# Altium schematic sheet DS_ZK_FINAL.SchDoc
size A1
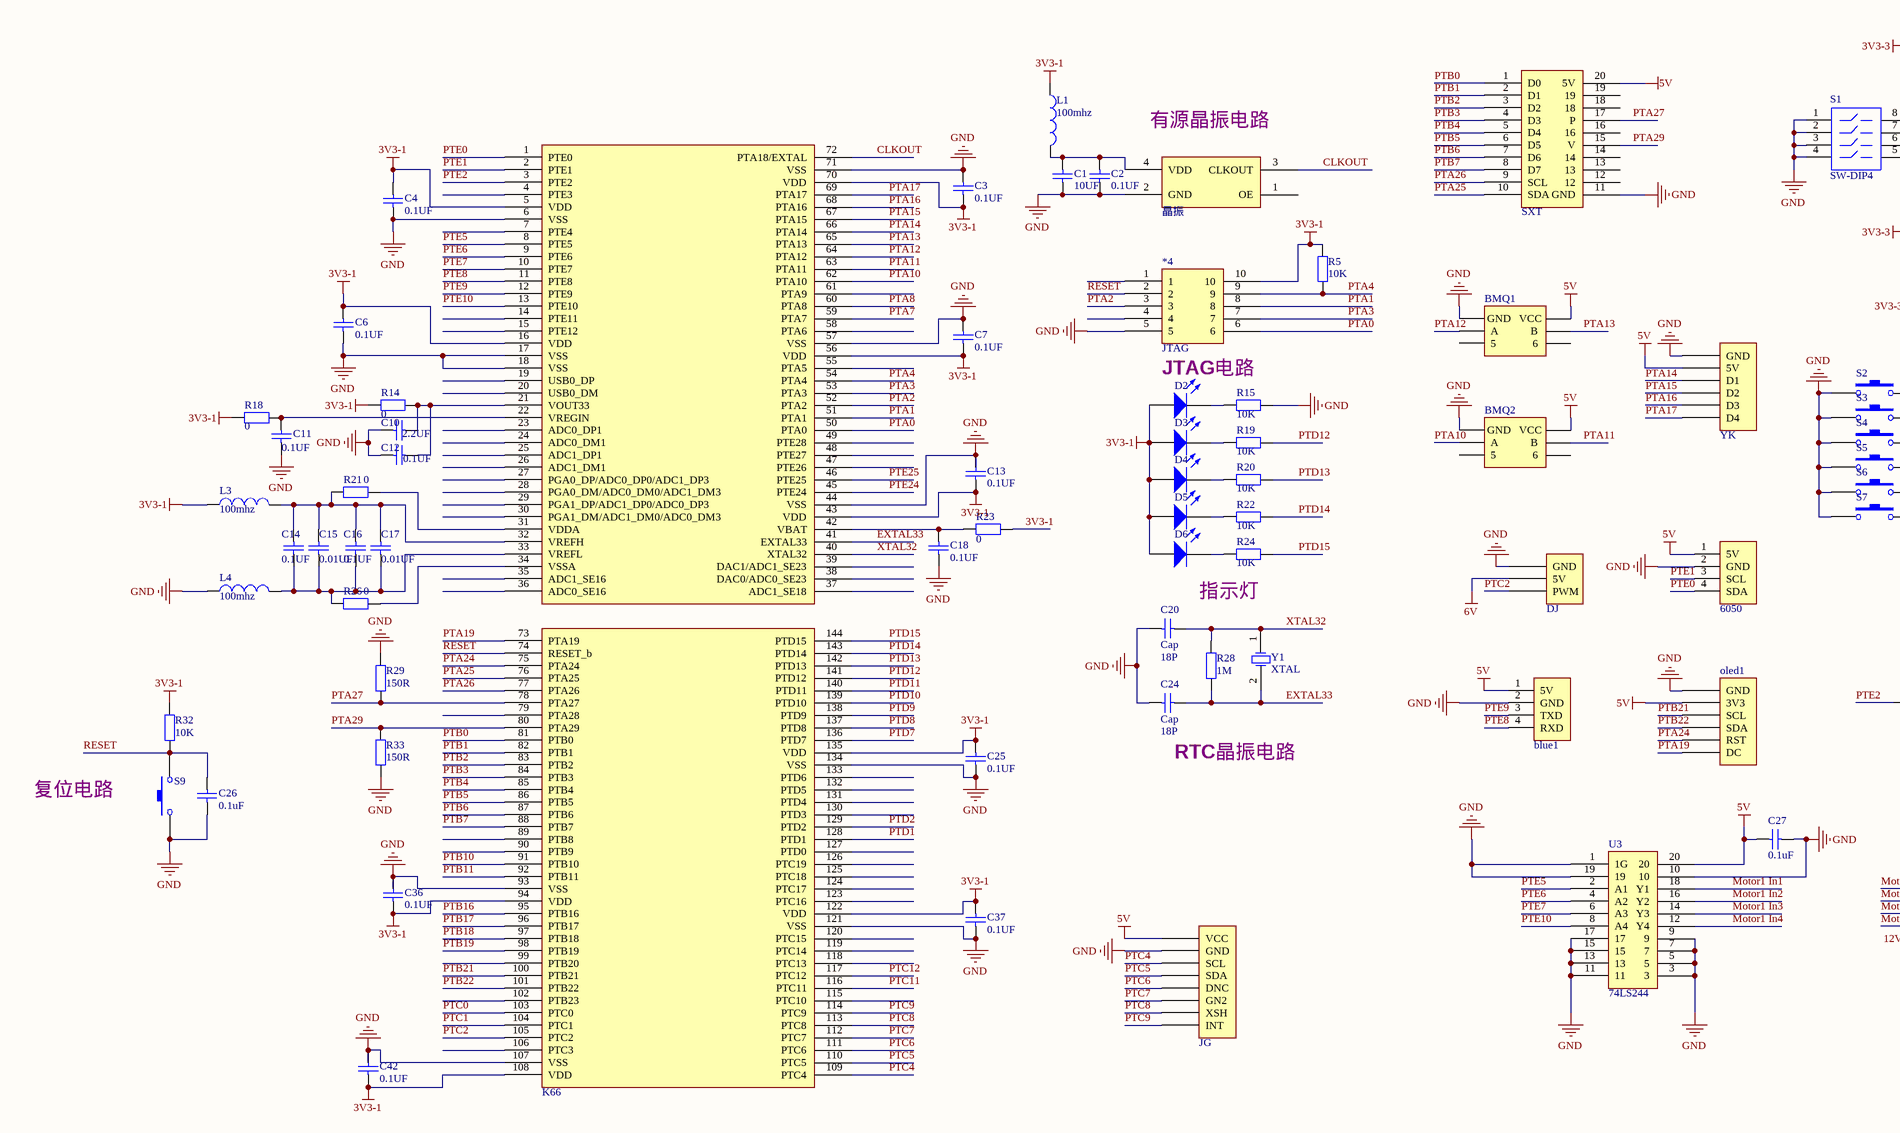
[diagram p0: DS_ZK_FINAL.SchDoc, top left]
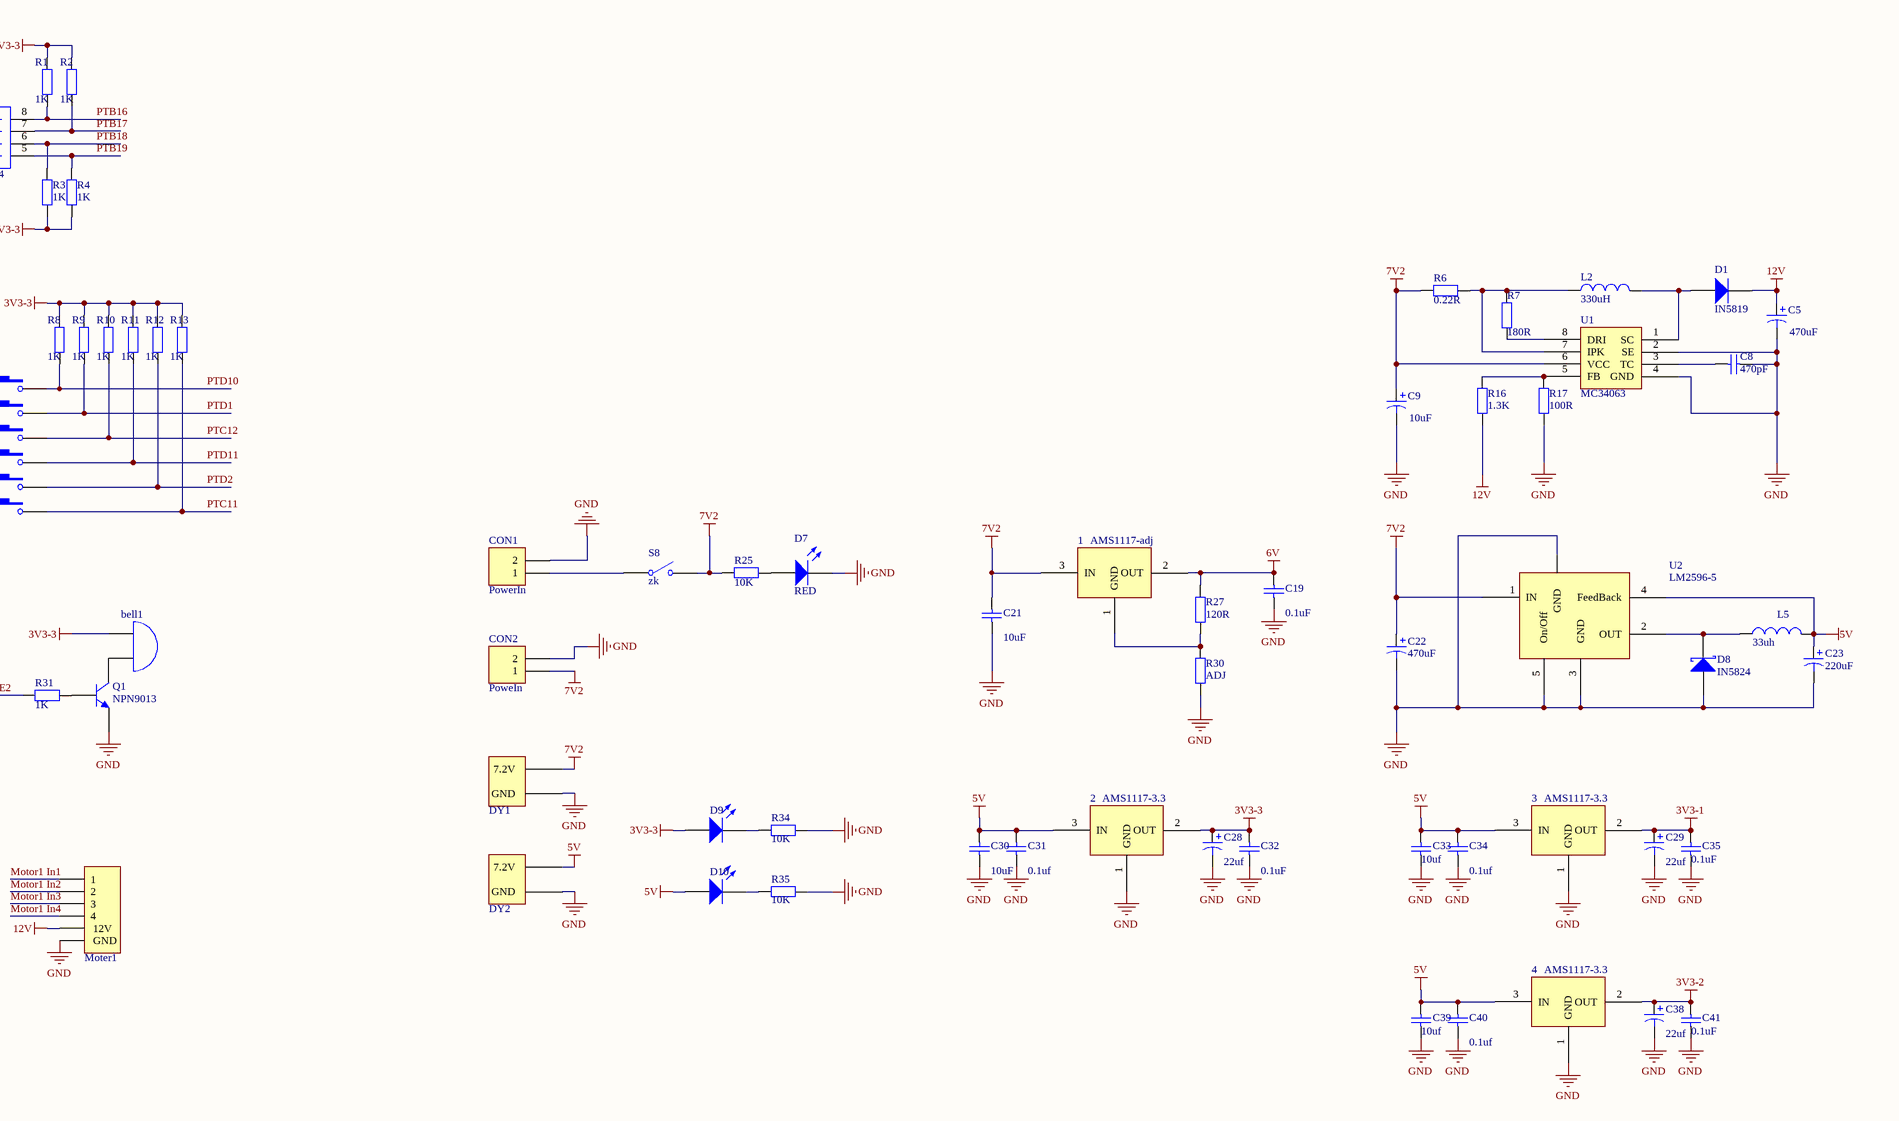
[diagram p1: DS_ZK_FINAL.SchDoc, top right]
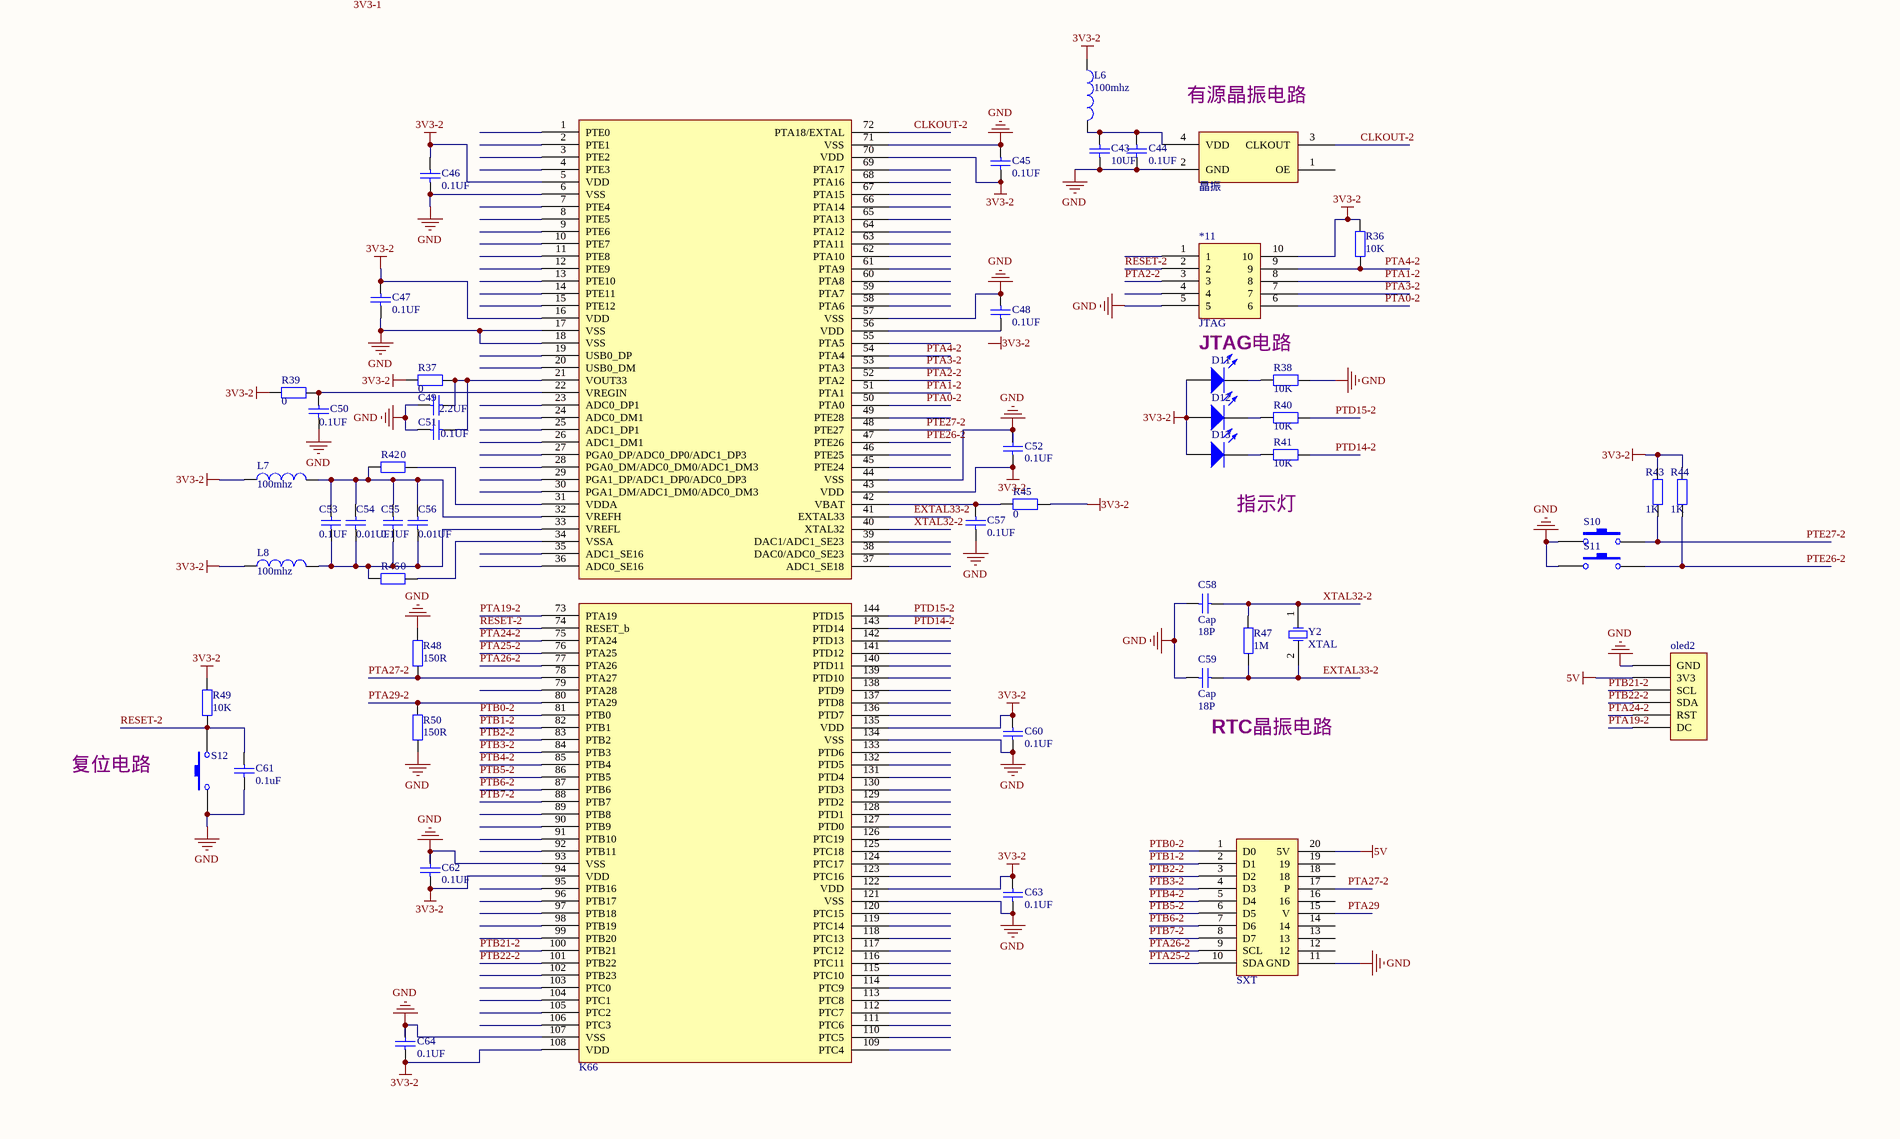
[diagram p2: DS_ZK_FINAL.SchDoc, bottom left]

## Parts
1  AMS1117-adj  [lm1117-5v]
2  AMS1117-3.3  [lm1117-5v]
3  AMS1117-3.3  [lm1117-5v]
4  AMS1117-3.3  [lm1117-5v]
*1  SXT  [SXT]
*2  K66  [LC-LQFP-144_20x20x05P]
*3  晶振  [LC-SMD-7050_4P]
*4  JTAG  [HDR2X5]
*5  YK  [HDR1X6]
*6  6050  [HDR1X4]
*7  DJ  [HDR1X3]
*8  JG  [HDR1X8]
*9  K66  [LC-LQFP-144_20x20x05P]
*10  晶振  [LC-SMD-7050_4P]
*11  JTAG  [HDR2X5]
*12  SXT  [SXT]
bell1  Bell  [bezzer]  (value not drawn)
blue1  blueteeth2  [HDR1X4]  (value not drawn)
BMQ1  encode_1  [HDR2X3]  (value not drawn)
BMQ2  encode_2  [HDR2X3]  (value not drawn)
C1  value 10UF  [0603]  (hidden comment: Cap)
C2  value 0.1UF  [0603]  (hidden comment: Cap)
C3  value 0.1UF  [0603]  (hidden comment: Cap)
C4  value 0.1UF  [0603]  (hidden comment: Cap)
C5  470uF  [470UF]
C6  value 0.1UF  [0603]  (hidden comment: Cap)
C7  value 0.1UF  [0603]  (hidden comment: Cap)
C8  470pF  [0805]
C9  10uF  [0805]
C10  value 2.2UF  [0603]  (hidden comment: Cap)
C11  value 0.1UF  [0603]  (hidden comment: Cap)
C12  value 0.1UF  [0603]  (hidden comment: Cap)
C13  value 0.1UF  [0603]  (hidden comment: Cap)
C14  value 0.1UF  [0603]  (hidden comment: Cap)
C15  value 0.01UF  [0603]  (hidden comment: Cap)
C16  value 0.1UF  [0603]  (hidden comment: Cap)
C17  value 0.01UF  [0603]  (hidden comment: Cap)
C18  value 0.1UF  [0603]  (hidden comment: Cap)
C19  value 0.1uF  [0805]  (hidden comment: Cap)
C20  Cap  value 18P  [0603]
C21  value 10uF  [0805]  (hidden comment: Cap)
C22  value 470uF  [470uf]  (hidden comment: Cap Pol1)
C23  value 220uF  [220uf]  (hidden comment: Cap Pol1)
C24  Cap  value 18P  [0603]
C25  value 0.1UF  [0603]  (hidden comment: Cap)
C26  value 0.1uF  [0805]  (hidden comment: Cap)
C27  0.1uF  [0805]
C28  value 22uf  [0805]  (hidden comment: Cap Pol1)
C29  value 22uf  [0805]  (hidden comment: Cap Pol1)
C30  value 10uF  [0805]  (hidden comment: Cap)
C31  value 0.1uf  [0805]  (hidden comment: Cap)
C32  value 0.1uF  [0805]  (hidden comment: Cap)
C33  value 10uf  [0805]  (hidden comment: Cap)
C34  value 0.1uf  [0805]  (hidden comment: Cap)
C35  value 0.1uF  [0805]  (hidden comment: Cap)
C36  value 0.1UF  [0603]  (hidden comment: Cap)
C37  value 0.1UF  [0603]  (hidden comment: Cap)
C38  value 22uf  [0805]  (hidden comment: Cap Pol1)
C39  value 10uf  [0805]  (hidden comment: Cap)
C40  value 0.1uf  [0805]  (hidden comment: Cap)
C41  value 0.1uF  [0805]  (hidden comment: Cap)
C42  value 0.1UF  [0603]  (hidden comment: Cap)
C43  value 10UF  [0603]  (hidden comment: Cap)
C44  value 0.1UF  [0603]  (hidden comment: Cap)
C45  value 0.1UF  [0603]  (hidden comment: Cap)
C46  value 0.1UF  [0603]  (hidden comment: Cap)
C47  value 0.1UF  [0603]  (hidden comment: Cap)
C48  value 0.1UF  [0603]  (hidden comment: Cap)
C49  value 2.2UF  [0603]  (hidden comment: Cap)
C50  value 0.1UF  [0603]  (hidden comment: Cap)
C51  value 0.1UF  [0603]  (hidden comment: Cap)
C52  value 0.1UF  [0603]  (hidden comment: Cap)
C53  value 0.1UF  [0603]  (hidden comment: Cap)
C54  value 0.01UF  [0603]  (hidden comment: Cap)
C55  value 0.1UF  [0603]  (hidden comment: Cap)
C56  value 0.01UF  [0603]  (hidden comment: Cap)
C57  value 0.1UF  [0603]  (hidden comment: Cap)
C58  Cap  value 18P  [0603]
C59  Cap  value 18P  [0603]
C60  value 0.1UF  [0603]  (hidden comment: Cap)
C61  value 0.1uF  [0805]  (hidden comment: Cap)
C62  value 0.1UF  [0603]  (hidden comment: Cap)
C63  value 0.1UF  [0603]  (hidden comment: Cap)
C64  value 0.1UF  [0603]  (hidden comment: Cap)
CON1  PowerIn  [DIZUO]
CON2  PoweIn  [KF301-2P]
D1  IN5819  [0805LED]
D2  LED0  [0805LED]  (value not drawn)
D3  LED0  [0805LED]  (value not drawn)
D4  LED0  [0805LED]  (value not drawn)
D5  LED0  [0805LED]  (value not drawn)
D6  LED0  [0805LED]  (value not drawn)
D7  RED  [0805LED]
D8  IN5824  [1N5824]
D9  LED0  [0805LED]  (value not drawn)
D10  LED0  [0805LED]  (value not drawn)
D11  LED0  [0805LED]  (value not drawn)
D12  LED0  [0805LED]  (value not drawn)
D13  LED0  [0805LED]  (value not drawn)
DY1  H1  [HDR1X2]  (value not drawn)
DY2  H1  [HDR1X2]  (value not drawn)
L1  value 100mhz  [0603]  (hidden comment: Inductor)
L2  330uH  [diangan]
L3  value 100mhz  [0603]  (hidden comment: Inductor)
L4  value 100mhz  [0603]  (hidden comment: Inductor)
L5  value 33uh  [diangan]  (hidden comment: Inductor)
L6  value 100mhz  [0603]  (hidden comment: Inductor)
L7  value 100mhz  [0603]  (hidden comment: Inductor)
L8  value 100mhz  [0603]  (hidden comment: Inductor)
Moter1  Motor  [HDR1X6]  (value not drawn)
oled1  OLED  [HDR1X6]  (value not drawn)
oled2  OLED  [HDR1X6]  (value not drawn)
Q1  NPN9013  [npn9013]
R1  value 1K  [0805]  (hidden comment: Res2)
R2  value 1K  [0805]  (hidden comment: Res2)
R3  value 1K  [0805]  (hidden comment: Res2)
R4  value 1K  [0805]  (hidden comment: Res2)
R5  value 10K  [0805]  (hidden comment: Res2)
R6  0.22R  [0603]
R7  180R  [0603]
R8  value 1K  [0805]  (hidden comment: Res2)
R9  value 1K  [0805]  (hidden comment: Res2)
R10  value 1K  [0805]  (hidden comment: Res2)
R11  value 1K  [0805]  (hidden comment: Res2)
R12  value 1K  [0805]  (hidden comment: Res2)
R13  value 1K  [0805]  (hidden comment: Res2)
R14  value 0  [0603]  (hidden comment: Res2)
R15  value 10K  [0805]  (hidden comment: Res2)
R16  1.3K  [0603]
R17  100R  [0603]
R18  value 0  [0603]  (hidden comment: Res2)
R19  value 10K  [0805]  (hidden comment: Res2)
R20  value 10K  [0805]  (hidden comment: Res2)
R21  value 0  [0603]  (hidden comment: Res2)
R22  value 10K  [0805]  (hidden comment: Res2)
R23  value 0  [0603]  (hidden comment: Res2)
R24  value 10K  [0805]  (hidden comment: Res2)
R25  value 10K  [0805]  (hidden comment: Res2)
R26  value 0  [0603]  (hidden comment: Res2)
R27  value 120R  [0805]  (hidden comment: Res2)
R28  value 1M  [0603]  (hidden comment: Res2)
R29  value 150R  [0805]  (hidden comment: Res2)
R30  value ADJ  [1*2]  (hidden comment: Res2)
R31  value 1K  [0805]  (hidden comment: Res2)
R32  value 10K  [0805]  (hidden comment: Res2)
R33  value 150R  [0805]  (hidden comment: Res2)
R34  value 10K  [0805]  (hidden comment: Res2)
R35  value 10K  [0805]  (hidden comment: Res2)
R36  value 10K  [0805]  (hidden comment: Res2)
R37  value 0  [0603]  (hidden comment: Res2)
R38  value 10K  [0805]  (hidden comment: Res2)
R39  value 0  [0603]  (hidden comment: Res2)
R40  value 10K  [0805]  (hidden comment: Res2)
R41  value 10K  [0805]  (hidden comment: Res2)
R42  value 0  [0603]  (hidden comment: Res2)
R43  value 1K  [0805]  (hidden comment: Res2)
R44  value 1K  [0805]  (hidden comment: Res2)
R45  value 0  [0603]  (hidden comment: Res2)
R46  value 0  [0603]  (hidden comment: Res2)
R47  value 1M  [0603]  (hidden comment: Res2)
R48  value 150R  [0805]  (hidden comment: Res2)
R49  value 10K  [0805]  (hidden comment: Res2)
R50  value 150R  [0805]  (hidden comment: Res2)
S1  SW-DIP4  [BMKG]
S2  SW-PB  [BUTTON]  (value not drawn)
S3  SW-PB  [BUTTON]  (value not drawn)
S4  SW-PB  [BUTTON]  (value not drawn)
S5  SW-PB  [BUTTON]  (value not drawn)
S6  SW-PB  [BUTTON]  (value not drawn)
S7  SW-PB  [BUTTON]  (value not drawn)
S8  zk  [SWITCH-MID]
S9  SW-PB  [BUTTON]  (value not drawn)
S10  SW-PB  [BUTTON]  (value not drawn)
S11  SW-PB  [BUTTON]  (value not drawn)
S12  SW-PB  [BUTTON]  (value not drawn)
U1  MC34063  [MC34063]
U2  LM2596-5  [LM2596]
U3  74LS244  [74ls244DA]
Y1  XTAL  [32.768]
Y2  XTAL  [32.768]

## Nets
3V3-1: 3.2(OUT) *2.5(VDD) *2.16(VDD) *2.43(VDD) *2.56(VDD) *2.70(VDD) *2.94(VDD) *2.108(VDD) *2.122(VDD) *2.135(VDD) *4.10 C3.1 C4.2 C6.2 C7.1 C13.1 C25.1 C29.1 C35.2 C36.1 C37.1 C42.1 D2.1(A) D3.1(A) D4.1(A) D5.1(A) D6.1(A) L1.1 L3.1 R5.2 R14.1 R18.1 R23.1 R32.1
3V3-2: 4.2(OUT) *9.5(VDD) *9.16(VDD) *9.43(VDD) *9.70(VDD) *9.94(VDD) *9.108(VDD) *9.122(VDD) *9.135(VDD) *11.10 C38.1 C41.2 C45.1 C46.2 C47.2 C52.1 C60.1 C62.1 C63.1 C64.1 D11.1(A) D12.1(A) D13.1(A) L6.1 L7.1 L8.1 R36.2 R37.1 R39.1 R43.2 R44.2 R45.1 R49.1
3V3-3: 2.2(OUT) bell1.1(A) C28.1 C32.2 D9.1(A) R1.2 R2.2 R3.2 R4.1 R8.2 R9.2 R10.2 R11.2 R12.2 R13.2
5V: 2.3(IN) 3.3(IN) 4.3(IN) *1.20(5V) *5.2(5V) *6.1(5V) *8.1(VCC) *12.20(5V) blue1.1(5V) BMQ1.2(VCC) BMQ2.2(VCC) C23.1 C27.2 C30.2 C31.2 C33.2 C34.2 C39.2 C40.2 D10.1(A) DY2.2(7.2V) L5.2 oled1.2(3V3) oled2.2(3V3) U2.4(FeedBack) U3.20
6V: 1.2(OUT) *7.2(5V) C19.2 R27.2
7V2: 1.3(IN) C9.1 C21.2 C22.1 CON2.1 DY1.2(7.2V) R6.2 R25.2 S8.2(NO) U1.6(VCC) U2.1(IN)
12V: C5.1 D1.2(K) Moter1.5(12V) R16.2
GND: 2.1(GND) 3.1(GND) 4.1(GND) *1.11(GND) *2.6(VSS) *2.17(VSS) *2.18(VSS) *2.44(VSS) *2.57(VSS) *2.71(VSS) *2.93(VSS) *2.107(VSS) *2.121(VSS) *2.134(VSS) *3.2(GND) *4.5 *5.1(GND) *6.2(GND) *7.1(GND) *8.2(GND) *9.6(VSS) *9.17(VSS) *9.18(VSS) *9.44(VSS) *9.57(VSS) *9.71(VSS) *9.93(VSS) *9.107(VSS) *9.121(VSS) *9.134(VSS) *10.2(GND) *11.5 *12.11(GND) blue1.2(GND) BMQ1.1(GND) BMQ2.1(GND) C1.1 C2.1 C3.2 C4.1 C5.2 C6.1 C7.2 C8.2 C9.2 C10.1 C11.1 C12.1 C13.2 C18.1 C19.1 C20.1 C21.1 C22.2 C23.2 C24.1 C25.2 C26.1 C27.1 C28.2 C29.2 C30.1 C31.1 C32.1 C33.1 C34.1 C35.1 C36.2 C37.2 C38.2 C39.1 C40.1 C41.1 C42.2 C43.1 C44.1 C45.2 C46.1 C47.1 C48.2 C49.1 C50.1 C51.1 C52.2 C57.1 C58.1 C59.1 C60.2 C61.1 C62.2 C63.2 C64.2 CON1.2 CON2.2 D7.2(K) D8.2(K) DY1.1(GND) DY2.1(GND) L4.1 Moter1.6(GND) oled1.1(GND) oled2.1(GND) Q1.1(E) R15.2 R17.2 R29.2 R30.1 R33.1 R34.2 R35.2 R38.2 R48.2 R50.1 S1.1 S1.2 S1.3 S1.4 S2.1 S3.1 S4.1 S5.1 S6.1 S7.1 S9.1 S10.1 S11.1 S12.1 U1.2(SE) U1.4(GND) U2.3(GND) U2.5(On/Off) U2.6(GND) U3.1(1G) U3.3 U3.5 U3.7 U3.9 U3.10 U3.11 U3.13 U3.15 U3.17 U3.19
CLKOUT: *2.72(PTA18/EXTAL) *3.3(CLKOUT)
CLKOUT-2: *9.72(PTA18/EXTAL) *10.3(CLKOUT)
EXTAL33: *2.41(EXTAL33) C24.2 R28.1 Y1.2(OSC2)
EXTAL33-2: *9.41(EXTAL33) C59.2 R47.1 Y2.2(OSC2)
Motor1 In1: Moter1.1 U3.18(Y1)
Motor1 In2: Moter1.2 U3.16(Y2)
Motor1 In3: Moter1.3 U3.14(Y3)
Motor1 In4: Moter1.4 U3.12(Y4)
PTA0: *2.50(PTA0) *4.6
PTA0-2: *9.50(PTA0) *11.6
PTA1: *2.51(PTA1) *4.8
PTA1-2: *9.51(PTA1) *11.8
PTA2: *2.52(PTA2) *4.3
PTA2-2: *9.52(PTA2) *11.3
PTA3: *2.53(PTA3) *4.7
PTA3-2: *9.53(PTA3) *11.7
PTA4: *2.54(PTA4) *4.9 R5.1
PTA4-2: *9.54(PTA4) *11.9 R36.1
PTA7: *2.59(PTA7)
PTA8: *2.60(PTA8)
PTA10: *2.62(PTA10) BMQ2.3(A)
PTA11: *2.63(PTA11) BMQ2.4(B)
PTA12: *2.64(PTA12) BMQ1.3(A)
PTA13: *2.65(PTA13) BMQ1.4(B)
PTA14: *2.66(PTA14) *5.3(D1)
PTA15: *2.67(PTA15) *5.4(D2)
PTA16: *2.68(PTA16) *5.5(D3)
PTA17: *2.69(PTA17) *5.6(D4)
PTA19: *2.73(PTA19) oled1.6(DC)
PTA19-2: *9.73(PTA19) oled2.6(DC)
PTA24: *2.75(PTA24) oled1.5(RST)
PTA24-2: *9.75(PTA24) oled2.5(RST)
PTA25: *1.10(SDA) *2.76(PTA25)
PTA25-2: *9.76(PTA25) *12.10(SDA)
PTA26: *1.9(SCL) *2.77(PTA26)
PTA26-2: *9.77(PTA26) *12.9(SCL)
PTA27: *1.17(P) *2.78(PTA27) R29.1
PTA27-2: *9.78(PTA27) *12.17(P) R48.1
PTA29: *1.15(V) *2.80(PTA29) *12.15(V) R33.2
PTA29-2: *9.80(PTA29) R50.2
PTB0: *1.1(D0) *2.81(PTB0)
PTB0-2: *9.81(PTB0) *12.1(D0)
PTB1: *1.2(D1) *2.82(PTB1)
PTB1-2: *9.82(PTB1) *12.2(D1)
PTB2: *1.3(D2) *2.83(PTB2)
PTB2-2: *9.83(PTB2) *12.3(D2)
PTB3: *1.4(D3) *2.84(PTB3)
PTB3-2: *9.84(PTB3) *12.4(D3)
PTB4: *1.5(D4) *2.85(PTB4)
PTB4-2: *9.85(PTB4) *12.5(D4)
PTB5: *1.6(D5) *2.86(PTB5)
PTB5-2: *9.86(PTB5) *12.6(D5)
PTB6: *1.7(D6) *2.87(PTB6)
PTB6-2: *9.87(PTB6) *12.7(D6)
PTB7: *1.8(D7) *2.88(PTB7)
PTB7-2: *9.88(PTB7) *12.8(D7)
PTB10: *2.91(PTB10)
PTB11: *2.92(PTB11)
PTB16: *2.95(PTB16) R1.1 S1.8
PTB17: *2.96(PTB17) R2.1 S1.7
PTB18: *2.97(PTB18) R3.1 S1.6
PTB19: *2.98(PTB19) R4.2 S1.5
PTB21: *2.100(PTB21) oled1.3(SCL)
PTB21-2: *9.100(PTB21) oled2.3(SCL)
PTB22: *2.101(PTB22) oled1.4(SDA)
PTB22-2: *9.101(PTB22) oled2.4(SDA)
PTC0: *2.103(PTC0)
PTC1: *2.104(PTC1)
PTC2: *2.105(PTC2) *7.3(PWM)
PTC4: *2.109(PTC4) *8.3(SCL)
PTC5: *2.110(PTC5) *8.4(SDA)
PTC6: *2.111(PTC6) *8.5(DNC)
PTC7: *2.112(PTC7) *8.6(GN2)
PTC8: *2.113(PTC8) *8.7(XSH)
PTC9: *2.114(PTC9) *8.8(INT)
PTC11: *2.116(PTC11) R13.1 S7.2
PTC12: *2.117(PTC12) R10.1 S4.2
PTD1: *2.128(PTD1) R9.1 S3.2
PTD2: *2.129(PTD2) R12.1 S6.2
PTD7: *2.136(PTD7)
PTD8: *2.137(PTD8)
PTD9: *2.138(PTD9)
PTD10: *2.139(PTD10) R8.1 S2.2
PTD11: *2.140(PTD11) R11.1 S5.2
PTD12: *2.141(PTD12) R19.2
PTD13: *2.142(PTD13) R20.2
PTD14: *2.143(PTD14) R22.2
PTD14-2: *9.143(PTD14) R41.2
PTD15: *2.144(PTD15) R24.2
PTD15-2: *9.144(PTD15) R40.2
PTE0: *2.1(PTE0) *6.4(SDA)
PTE1: *2.2(PTE1) *6.3(SCL)
PTE2: *2.3(PTE2) R31.1
PTE5: *2.8(PTE5) U3.2(A1)
PTE6: *2.9(PTE6) U3.4(A2)
PTE7: *2.10(PTE7) U3.6(A3)
PTE8: *2.11(PTE8) blue1.4(RXD)
PTE9: *2.12(PTE9) blue1.3(TXD)
PTE10: *2.13(PTE10) U3.8(A4)
PTE24: *2.45(PTE24)
PTE25: *2.46(PTE25)
PTE26-2: *9.47(PTE26) R44.1 S11.2
PTE27-2: *9.48(PTE27) R43.1 S10.2
RESET: *2.74(RESET_b) *4.2 C26.2 R32.2 S9.2
RESET-2: *9.74(RESET_b) *11.2 C61.2 R49.2 S12.2
XTAL32: *2.40(XTAL32) C20.2 R28.2 Y1.1(OSC1)
XTAL32-2: *9.40(XTAL32) C58.2 R47.2 Y2.1(OSC1)
Net1_1: 1.1(GND) R27.1 R30.2
Net*2_21: *2.21(VOUT33) C10.2 C12.2 R14.2
Net*2_22: *2.22(VREGIN) C11.2 R18.2
Net*2_31: *2.31(VDDA) R21.2
Net*2_32: *2.32(VREFH) C14.2 C15.2 C16.2 C17.2 L3.2 R21.1
Net*2_33: *2.33(VREFL) C14.1 C15.1 C16.1 C17.1 L4.2 R26.1
Net*2_34: *2.34(VSSA) R26.2
Net*2_42: *2.42(VBAT) C18.2 R23.2
Net*3_4: *3.4(VDD) C1.2 C2.2 L1.2
Net*9_21: *9.21(VOUT33) C49.2 C51.2 R37.2
Net*9_22: *9.22(VREGIN) C50.2 R39.2
Net*9_31: *9.31(VDDA) R42.2
Net*9_32: *9.32(VREFH) C53.2 C54.2 C55.2 C56.2 L7.2 R42.1
Net*9_33: *9.33(VREFL) C53.1 C54.1 C55.1 C56.1 L8.2 R46.1
Net*9_34: *9.34(VSSA) R46.2
Net*9_42: *9.42(VBAT) C57.2 R45.2
Net*9_56: *9.56(VDD) C48.1
Net*10_4: *10.4(VDD) C43.2 C44.2 L6.2
Netbell1_2: bell1.2(B) Q1.3(C)
NetC8_1: C8.1 U1.3(TC)
NetCON1_1: CON1.1 S8.1(COMMON)
NetD1_1: D1.1(A) L2.2 U1.1(SC)
NetD2_2: D2.2(K) R15.1
NetD3_2: D3.2(K) R19.1
NetD4_2: D4.2(K) R20.1
NetD5_2: D5.2(K) R22.1
NetD6_2: D6.2(K) R24.1
NetD7_1: D7.1(A) R25.1
NetD8_1: D8.1(A) L5.1 U2.2(OUT)
NetD9_2: D9.2(K) R34.1
NetD10_2: D10.2(K) R35.1
NetD11_2: D11.2(K) R38.1
NetD12_2: D12.2(K) R40.1
NetD13_2: D13.2(K) R41.1
NetL2_1: L2.1 R6.1 R7.2 U1.7(IPK)
NetQ1_2: Q1.2(B) R31.2
NetR7_1: R7.1 U1.8(DRI)
NetR16_1: R16.1 R17.1 U1.5(FB)

Not connected (* = marked no-connect by the designer): *1 12 13 14 16 18 19; *2 4(PTE3) 7(PTE4) 14(PTE11) 15(PTE12) 19(USB0_DP) 20(USB0_DM) 23(ADC0_DP1) 24(ADC0_DM1) 25(ADC1_DP1) 26(ADC1_DM1) 27(PGA0_DP/ADC0_DP0/ADC1_DP3) 28(PGA0_DM/ADC0_DM0/ADC1_DM3) 29(PGA1_DP/ADC1_DP0/ADC0_DP3) 30(PGA1_DM/ADC1_DM0/ADC0_DM3) 35(ADC1_SE16) 36(ADC0_SE16) 37(ADC1_SE18) 38(DAC0/ADC0_SE23) 39(DAC1/ADC1_SE23) 47(PTE26) 48(PTE27) 49(PTE28) 55(PTA5) 58(PTA6) 61(PTA9) 79(PTA28) 89(PTB8) 90(PTB9) 99(PTB20) 102(PTB23) 106(PTC3) 115(PTC10) 118(PTC13) 119(PTC14) 120(PTC15) 123(PTC16) 124(PTC17) 125(PTC18) 126(PTC19) 127(PTD0) 130(PTD3) 131(PTD4) 132(PTD5) 133(PTD6); *3 1(OE); *4 1 4; *9 1(PTE0) 2(PTE1) 3(PTE2) 4(PTE3) 7(PTE4) 8(PTE5) 9(PTE6) 10(PTE7) 11(PTE8) 12(PTE9) 13(PTE10) 14(PTE11) 15(PTE12) 19(USB0_DP) 20(USB0_DM) 23(ADC0_DP1) 24(ADC0_DM1) 25(ADC1_DP1) 26(ADC1_DM1) 27(PGA0_DP/ADC0_DP0/ADC1_DP3) 28(PGA0_DM/ADC0_DM0/ADC1_DM3) 29(PGA1_DP/ADC1_DP0/ADC0_DP3) 30(PGA1_DM/ADC1_DM0/ADC0_DM3) 35(ADC1_SE16) 36(ADC0_SE16) 37(ADC1_SE18) 38(DAC0/ADC0_SE23) 39(DAC1/ADC1_SE23) 45(PTE24) 46(PTE25) 49(PTE28) 55(PTA5) 58(PTA6) 59(PTA7) 60(PTA8) 61(PTA9) 62(PTA10) 63(PTA11) 64(PTA12) 65(PTA13) 66(PTA14) 67(PTA15) 68(PTA16) 69(PTA17) 79(PTA28) 89(PTB8) 90(PTB9) 91(PTB10) 92(PTB11) 95(PTB16) 96(PTB17) 97(PTB18) 98(PTB19) 99(PTB20) 102(PTB23) 103(PTC0) 104(PTC1) 105(PTC2) 106(PTC3) 109(PTC4) 110(PTC5) 111(PTC6) 112(PTC7) 113(PTC8) 114(PTC9) 115(PTC10) 116(PTC11) 117(PTC12) 118(PTC13) 119(PTC14) 120(PTC15) 123(PTC16) 124(PTC17) 125(PTC18) 126(PTC19) 127(PTD0) 128(PTD1) 129(PTD2) 130(PTD3) 131(PTD4) 132(PTD5) 133(PTD6) 136(PTD7) 137(PTD8) 138(PTD9) 139(PTD10) 140(PTD11) 141(PTD12) 142(PTD13); *10 1(OE); *11 1 4; *12 12 13 14 16 18 19; BMQ1 5 6; BMQ2 5 6

## Notes on the sheet
- (near *3) 有源晶振电路
- JTAG电路
- 指示灯
- (near C24) RTC晶振电路
- 复位电路
- (near *10) 有源晶振电路
- (near C59) RTC晶振电路
- Labels drawn without touching a wire or pin: 3V3-2

## Library data of the parts
1-4 = LT1117-3.3
*1 *12 = 摄像头
*5 = 遥控
*7 = 舵机
*8 = 激光
bell1 = Bell: Electrical Bell; Published: 24-Mar-1999; LatestRevisionDate: 17-Jul-2002; LatestRevisionNote: Re-released for DXP Platform.; PackageReference: PIN2; Publisher: Altium Limited
blue1 = blueteeth
BMQ1 BMQ2 = encode
C1-C4 C6 C7 C10-C21 C24-C26 C30-C37 C39-C64 = Cap: Capacitor; Published: 8-Jun-2000; LatestRevisionDate: 17-Jul-2002; LatestRevisionNote: Re-released for DXP Platform.; PackageReference: RAD-0.3; Publisher: Altium Limited; PackageDescription: Radial Cap, Thru-Hole; 2 Leads; 0.3 in Pin Spacing
C5 C9 = Cap Pol3: Polarized Capacitor (Surface Mount); Published: 8-Jun-2000; LatestRevisionDate: 29-May-2009; LatestRevisionNote: IPC-7351 Footprint Added.; PackageReference: C0805; Publisher: Altium Limited; PackageDescription: Chip Capacitor
  C5: Value: 470uF
  C9: Value: 10uF
C8 C27 = Cap Semi: Capacitor (Semiconductor SIM Model); Published: 8-Jun-2000; LatestRevisionDate: 29-May-2009; LatestRevisionNote: IPC-7351 Footprint Added.; PackageReference: C1206; Publisher: Altium Limited; PackageDescription: Chip Capacitor
  C8: Value: 470pF
  C27: Value: 0.1uF
C22 C23 C28 C29 C38 = Cap Pol1: Polarized Capacitor (Radial); Published: 8-Jun-2000; LatestRevisionDate: 17-Jul-2002; LatestRevisionNote: Re-released for DXP Platform.; PackageReference: RB7.6-15; Publisher: Altium Limited; PackageDescription: Polarized Capacitor (Radial); 2 Leads
CON1 CON2 = Header 2: Header, 2-Pin; LatestRevisionDate: 17-Jul-2002; LatestRevisionNote: Re-released for DXP Platform.; Publisher: Altium Limited
D1 = Diode: Default Diode; Published: 8-Jun-2000; LatestRevisionDate: 17-Jul-2002; LatestRevisionNote: Re-released for DXP Platform.; PackageVersion: Sep-1996; PackageReference: SMC; Publisher: Altium Limited; PackageDescription: DO-214-AB/SMC; 2 C-Bend Leads; Body 7.9 x 5.9 mm, inc. leads (LxW); Code_JEDEC: DO-214-AB
D2-D6 D9-D13 = LED0: Typical INFRARED GaAs LED; Published: 8-Jun-2000; LatestRevisionDate: 08-Jul-2005; LatestRevisionNote: Mech Layer 1 removed.; PackageReference: LED-0; Publisher: Altium Limited; PackageDescription: LED; 2 Leads
D7 = LED2: Typical RED, GREEN, YELLOW, AMBER GaAs LED; Published: 8-Jun-2000; LatestRevisionDate: 17-Jul-2002; LatestRevisionNote: Re-released for DXP Platform.; PackageVersion: Feb-2002; PackageReference: 3.2X1.6X1.1; Publisher: Altium Limited; PackageDescription: SM LED; 2 Flat Leads
L1-L8 = Inductor: Code_IEC: 1005; Published: 8-Jun-2000; LatestRevisionDate: 29-May-2009; LatestRevisionNote: IPC-7351 Footprint Added.; PackageReference: 0402-A; Publisher: Altium Limited; PackageDescription: Chip Inductor; Code_JEITA: 0402
  L2: Value: 330uH
Q1 = 2N3904: NPN General Purpose Amplifier; Published: 8-Jun-2000; LatestRevisionDate: 15-Jan-2003; LatestRevisionNote: PCB Footprint 'BCY-W3/D4.7' replaced; DatasheetVersion: 1997; PackageVersion: Sep-1998; PackageReference: TO-92A; Publisher: Altium Limited; PackageDescription: TO, Flat Index; 3 In-Line, Axial Leads; Body Dia. 4.5mm; Leads 0.51 x 0.48 mm (max); ComponentLink1Description: Manufacturer Link; ComponentLink1URL: http://www.fairchildsemi.com/; ComponentLink2Description: Datasheet; ComponentLink2URL: http://www.fairchildsemi.com/ds/2N%2F2N3904.pdf
R1-R50 = Res2: Resistor; Published: 8-Jun-2000; LatestRevisionDate: 17-Jul-2002; LatestRevisionNote: Re-released for DXP Platform.; PackageReference: AXIAL-0.4; Publisher: Altium Limited; PackageDescription: Axial Device, Thru-Hole; 2 Leads; 0.4 in Pin Spacing
  R6: Value: 0.22R
  R7: Value: 180R
  R16: Value: 1.3K
  R17: Value: 100R
S1 = SW-DIP4: DIP Switch; Published: 24-Mar-1999; LatestRevisionDate: 17-Jul-2002; LatestRevisionNote: Re-released for DXP Platform.; PackageReference: DIP-8; Publisher: Altium Limited
S2-S7 S10 S11 = SW-PB: Switch; Published: 24-Mar-1999; LatestRevisionDate: 17-Jul-2002; LatestRevisionNote: Re-released for DXP Platform.; PackageReference: SPST-2; Publisher: Altium Limited; PackageDescription: Switch; 2 Leads
S8 = SW-SPST: Single-Pole, Single-Throw Switch; Published: 24-Mar-1999; LatestRevisionDate: 17-Jul-2002; LatestRevisionNote: Re-released for DXP Platform.; PackageReference: SPST-2; Publisher: Altium Limited; PackageDescription: Switch; 2 Leads
S9 S12 = SW-PB: 按键; Published: 24-Mar-1999; LatestRevisionDate: 17-Jul-2002; LatestRevisionNote: Re-released for DXP Platform.; PackageReference: SPST-2; Publisher: Altium Limited; PackageDescription: Switch; 2 Leads
U2 = LM2596
Y1 Y2 = XTAL: Crystal Oscillator; Published: 8-Jun-2000; LatestRevisionDate: 17-Jul-2002; LatestRevisionNote: Re-released for DXP Platform.; PackageReference: R38; Publisher: Altium Limited; PackageDescription: Crystal, Thru-Hole; 2 Leads; Body 3.1 x 8.2 mm (Dia.xH)